# Altium schematic sheet OSSI-1 EPS_1.SchDoc: TITLE:
size 410 x 286 mm; Date: Date:; >LAST_DATE_TIME: 01/11/2015 13:27:49; Sheet:: Sheet:; >SHEET: 2; REV:: REV:; Document Number:: Document Number:; >DRAWING_NAME: OSSI-1 EPS.sch
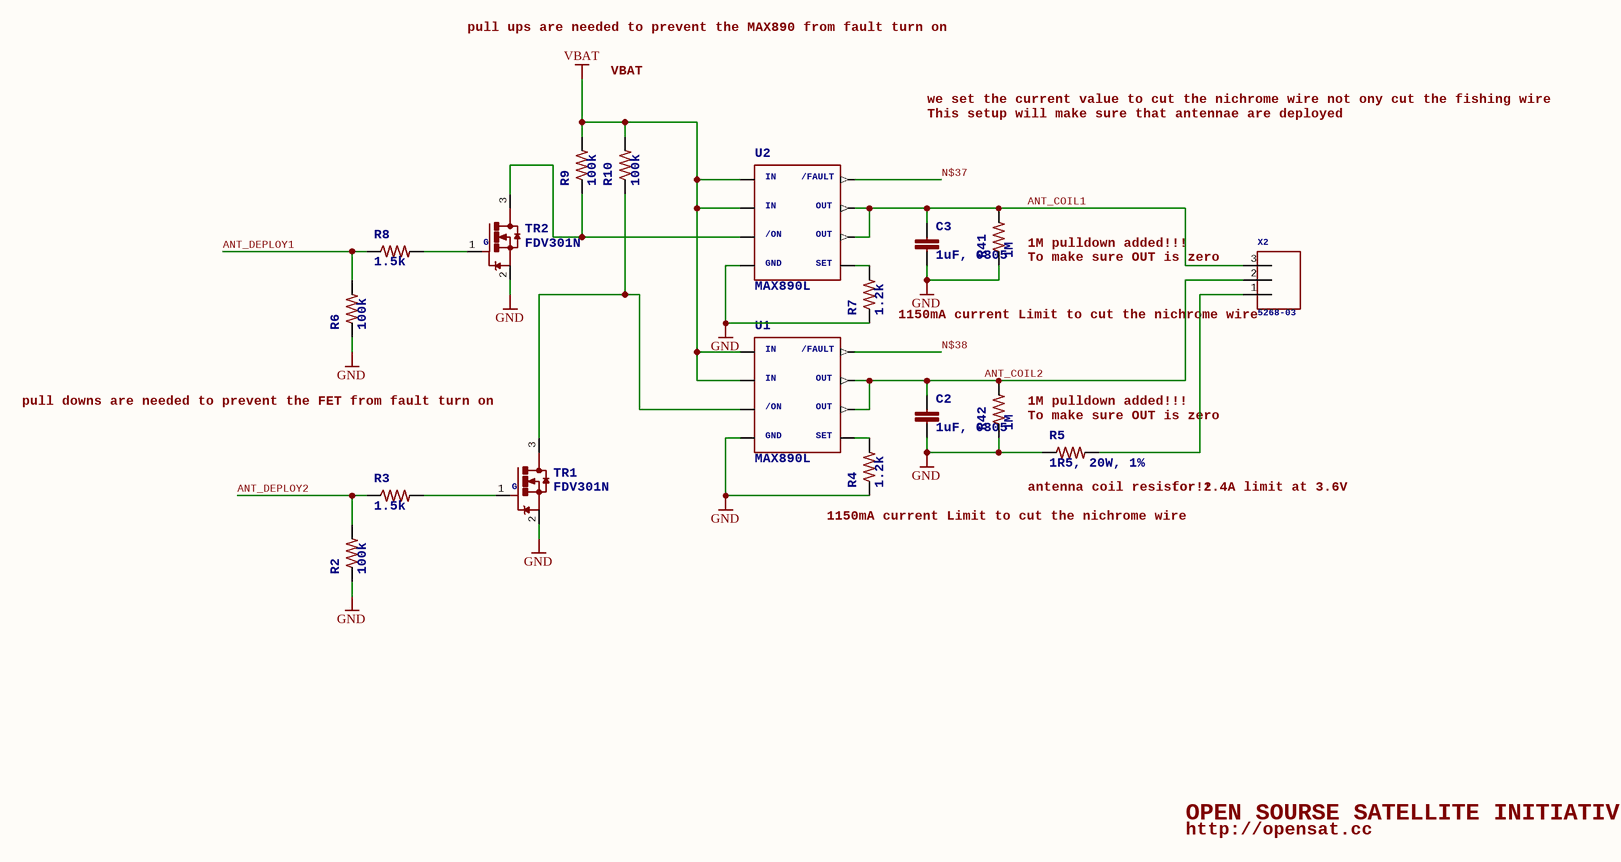
[diagram p0: OSSI-1 EPS_1.SchDoc]

## Parts
C2  >NAME: C2  [C0805(2012)]  (hidden comment: 1uF, 0805)
C3  >NAME: C3  [C0805(2012)]  (hidden comment: 1uF, 0805)
R2  >NAME: R2  [R0603(1608)]  (hidden comment: 100k)
R3  >NAME: R3  [R0603(1608)]  (hidden comment: 1.5k)
R4  >NAME: R4  [R0603(1608)]  (hidden comment: 1.2k)
R5  >NAME: R5  [PWR263S-20]  (hidden comment: 1R5, 20W, 1%)
R6  >NAME: R6  [R0603(1608)]  (hidden comment: 100k)
R7  >NAME: R7  [R0603(1608)]  (hidden comment: 1.2k)
R8  >NAME: R8  [R0603(1608)]  (hidden comment: 1.5k)
R9  >NAME: R9  [R0603(1608)]  (hidden comment: 100k)
R10  >NAME: R10  [R0603(1608)]  (hidden comment: 100k)
R41  >NAME: R41  [R0603(1608)]  (hidden comment: 1M)
R42  >NAME: R42  [R0603(1608)]  (hidden comment: 1M)
TR1  >NAME: TR1  [SOT23]  (hidden comment: FDV301N)
TR2  >NAME: TR2  [SOT23]  (hidden comment: FDV301N)
U1  >NAME: U1  [SO8]  (hidden comment: MAX890L)
U2  >NAME: U2  [SO8]  (hidden comment: MAX890L)
X2  >NAME: X2  [5268-03]  (hidden comment: 5268-03)

## Nets
GND: C2.2 C3.2 R2.1 R4.1 R5.P$1 R6.1 R7.1 R41.1 R42.1 TR1.2(S) TR2.2(S) U1.4(P$4) U2.4(P$4)
VBAT: R9.2 R10.2 U1.1(P$1) U1.2(P$2) U2.1(P$1) U2.2(P$2)
ANT_COIL1: C3.1 R41.2 U2.6(P$6) U2.7(P$7) X2.3
ANT_COIL2: C2.1 R42.2 U1.6(P$6) U1.7(P$7) X2.2
ANT_DEPLOY1: R6.2 R8.1
ANT_DEPLOY2: R2.2 R3.1
N$37: U2.8(P$8)
N$38: U1.8(P$8)
NetR3_2: R3.2 TR1.1(G)
NetR4_2: R4.2 U1.5(P$5)
NetR5_P$2: R5.P$2 X2.1
NetR7_2: R7.2 U2.5(P$5)
NetR8_2: R8.2 TR2.1(G)
NetR9_1: R9.1 TR2.3(D) U2.3(P$3)
NetR10_1: R10.1 TR1.3(D) U1.3(P$3)

## Notes on the sheet
- pull ups are needed to prevent the MAX890 from fault turn on
- VBAT
- we set the current value to cut the nichrome wire not ony cut the fishing wire
- This setup will make sure that antennae are deployed
- (near R41) 1M pulldown added!!!
- (near R41) To make sure OUT is zero
- (near R7) 1150mA current Limit to cut the nichrome wire
- pull downs are needed to prevent the FET from fault turn on
- 1M pulldown added!!!
- To make sure OUT is zero
- (near R5) antenna coil resistor!!
- for 2.4A limit at 3.6V
- (near R4) 1150mA current Limit to cut the nichrome wire
- OPEN SOURSE SATELLITE INITIATIVE
- http://opensat.cc

## Library data of the parts
C2 C3 = C0805(2012): >VALUE: 1uF, 0805
R2-R4 R6-R10 R41 R42 = R0603(1608)
  R2 R6 R9 R10: >VALUE: 100k
  R3 R8: >VALUE: 1.5k
  R4 R7: >VALUE: 1.2k
  R41 R42: >VALUE: 1M
R5 = RPWR263S: >VALUE: 1R5, 20W, 1%
TR1 TR2 = FDV301N: FDV301N Digital N channel - FET / Rdson = 5 Ohm / Vgs = 0.7~1.06V / Ids = 220mA; G: G; >VALUE: FDV301N
U1 U2 = MAX890L: <B>MAX 890L</B> / <BR /> / 1.2A, Current-Limited, High-Side / P-Channel Switch with Thermal Shutdown BY MAXIM; IN: IN; /ON: /ON; GND: GND; SET: SET; OUT: OUT; /FAULT: /FAULT; >VALUE: MAX890L
X2 = 5268-03: >VALUE: 5268-03